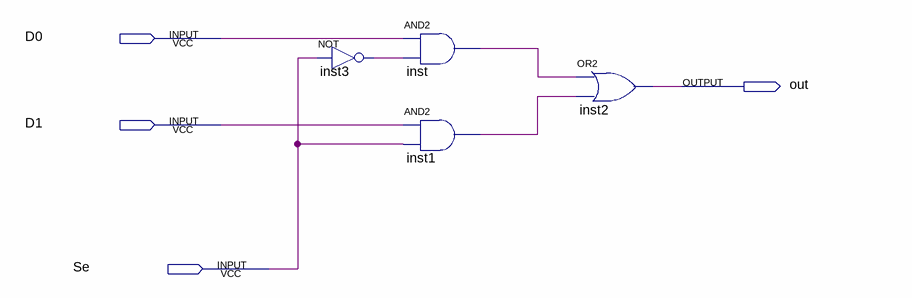
[diagram p0: schematic sheet]
// Quartus schematic mux2_1.bdf as structural Verilog: 4 symbols, 4 pins
module mux2_1 (
  input  D0,
  input  D1,
  input  Se,
  output out
);

  wire inst1_out, inst3_out, inst_out;

  not inst3 (inst3_out, Se);
  and inst (inst_out, D0, inst3_out);
  and inst1 (inst1_out, D1, Se);
  or inst2 (out, inst_out, inst1_out);
endmodule
